# EAGLE schematic DCToACInverter_schematic (EAGLE 9.7.0)
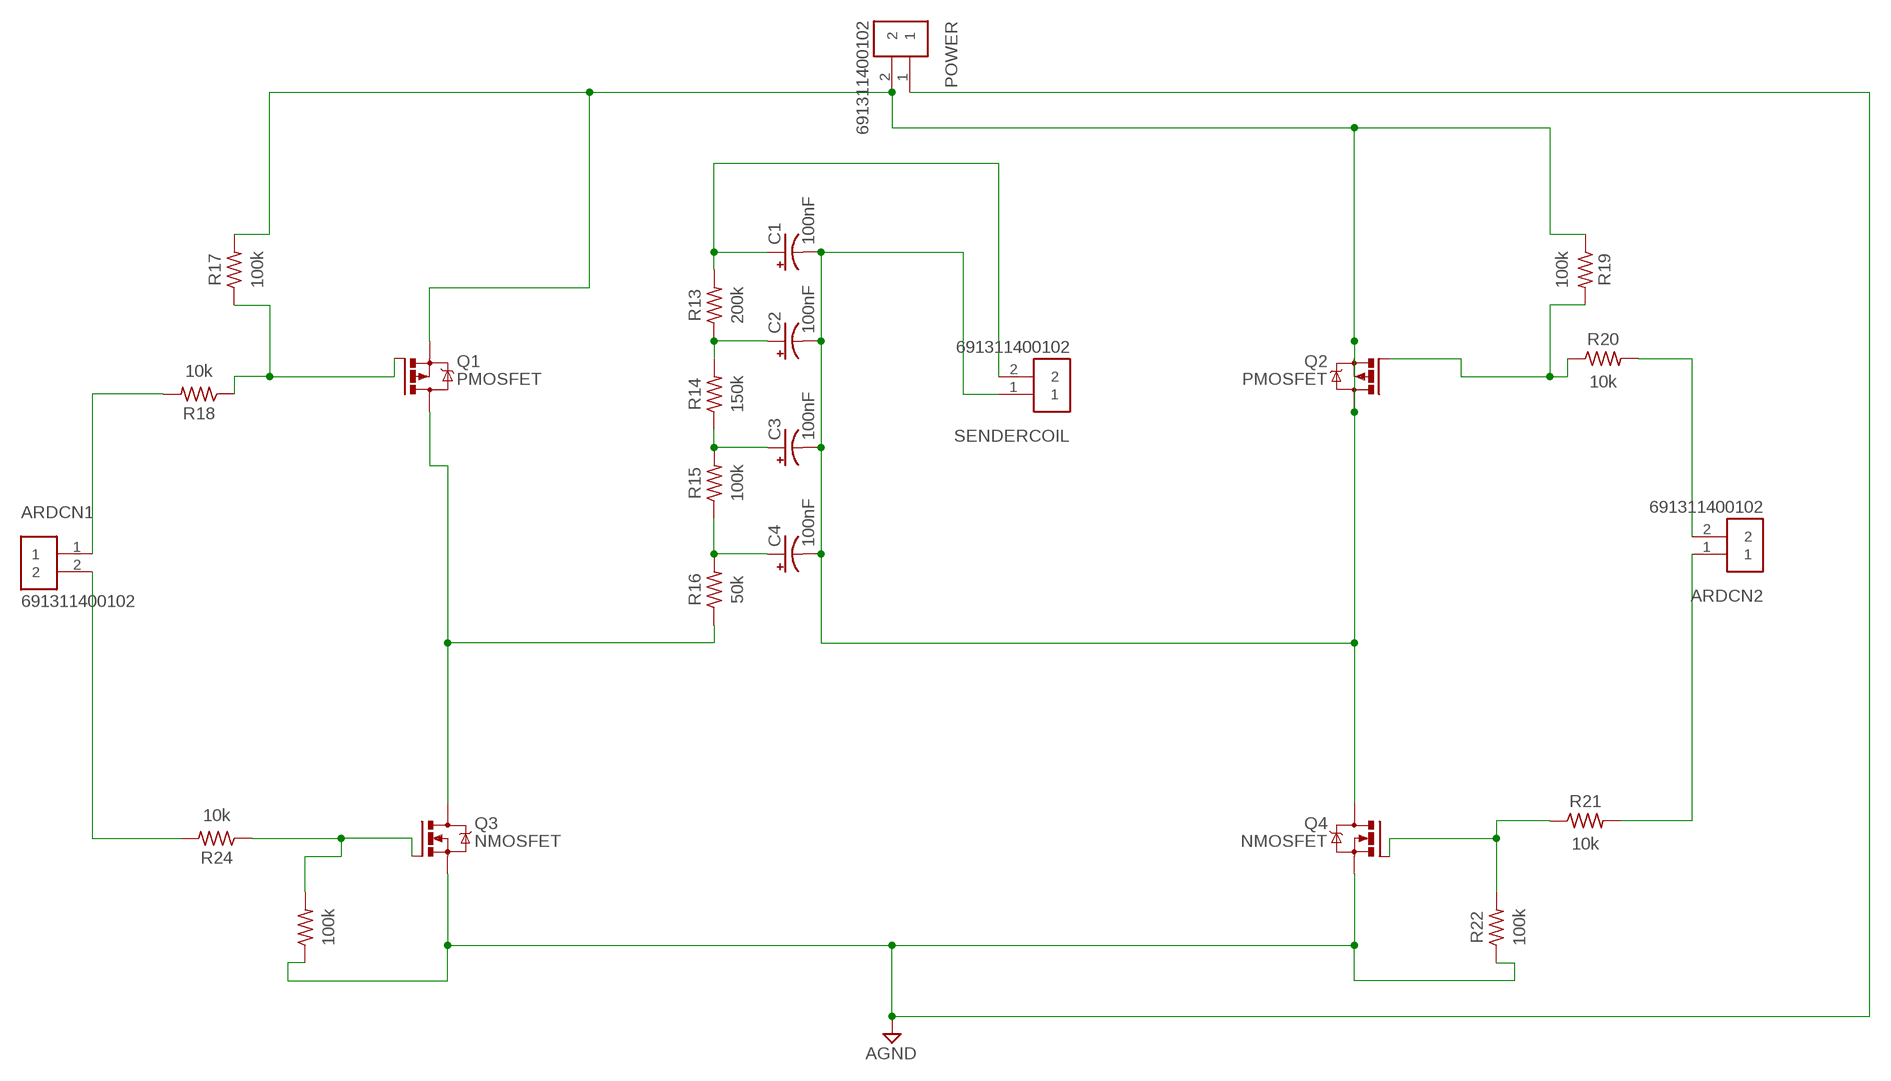
[diagram p0: schematic, sheet 1]

## Parts
ARDCN1  691311400102  [TERMINALBLOCK_PLUGGABLE-2-7.62MM]
ARDCN2  691311400102  [TERMINALBLOCK_PLUGGABLE-2-7.62MM]
C1  100nF  C-POL-US_AXIAL-34.1MM-PITCH  [CAPPAD3410W80L3025D1825B]
C2  100nF  C-POL-US_AXIAL-34.1MM-PITCH  [CAPPAD3410W80L3025D1825B]
C3  100nF  C-POL-US_AXIAL-34.1MM-PITCH  [CAPPAD3410W80L3025D1825B]
C4  100nF  C-POL-US_AXIAL-34.1MM-PITCH  [CAPPAD3410W80L3025D1825B]
POWER  691311400102  [TERMINALBLOCK_PLUGGABLE-2-7.62MM]
Q1  PMOSFET  PMOSFET_SOT23-GSD  [SOT23]
Q2  PMOSFET  PMOSFET_SOT23-GSD  [SOT23]
Q3  NMOSFET  NMOSFET_TO220  [TO220BV]
Q4  NMOSFET  NMOSFET_TO220  [TO220BV]
R13  200k  R-US_AXIAL-7.2MM-PITCH  [RESAD724W46L381D178B]
R14  150k  R-US_AXIAL-7.2MM-PITCH  [RESAD724W46L381D178B]
R15  100k  R-US_AXIAL-7.2MM-PITCH  [RESAD724W46L381D178B]
R16  50k  R-US_AXIAL-7.2MM-PITCH  [RESAD724W46L381D178B]
R17  100k  R-US_AXIAL-7.2MM-PITCH  [RESAD724W46L381D178B]
R18  10k  R-US_AXIAL-7.2MM-PITCH  [RESAD724W46L381D178B]
R19  100k  R-US_AXIAL-7.2MM-PITCH  [RESAD724W46L381D178B]
R20  10k  R-US_AXIAL-7.2MM-PITCH  [RESAD724W46L381D178B]
R21  10k  R-US_AXIAL-7.2MM-PITCH  [RESAD724W46L381D178B]
R22  100k  R-US_AXIAL-7.2MM-PITCH  [RESAD724W46L381D178B]
R23  100k  R-US_AXIAL-7.2MM-PITCH  [RESAD724W46L381D178B]
R24  10k  R-US_AXIAL-7.2MM-PITCH  [RESAD724W46L381D178B]
SENDERCOIL  691311400102  [TERMINALBLOCK_PLUGGABLE-2-7.62MM]

## Nets
AGND: POWER.1 Q3.S Q4.S R22.1 R23.1
N$1: Q1.1(G) R17.1 R18.1
N$2: C1.1(+) R13.2 SENDERCOIL.2
N$3: Q2.1(G) R19.2 R20.1
N$4: C2.1(+) R13.1 R14.2
N$5: Q3.G R23.2 R24.1
N$6: C3.1(+) R14.1 R15.2
N$7: Q1.3(D) Q3.D R16.1
N$8: Q4.G R21.1 R22.2
N$9: C4.1(+) R15.1 R16.2
N$10: ARDCN2.2 R20.2
N$11: ARDCN2.1 R21.2
N$12: ARDCN1.1 R18.2
N$13: ARDCN1.2 R24.2
N$14: C1.2(-) C2.2(-) C3.2(-) C4.2(-) POWER.2 Q1.2(S) Q2.2(S) Q2.3(D) Q4.D R17.2 R19.1 SENDERCOIL.1

## Library data of the parts
ARDCN1 ARDCN2 POWER SENDERCOIL = Terminal Blocks:691311400102: 7.62MM CLOSE VERTICAL PCB HEADER WR-TBL Manufacturer's datasheet <https://katalog.we-online.com/em/datasheet/6913114001xx.pdf>; CREATED_BY: PCBLayout.com; DIGIKEY_PART_NO: 732-2823-ND; MANUFACTURER: WURTH ELEKTRONIK; MPN: 691311400102
C1-C4 = Capacitor:C-POL-US: Capacitor Polarised - ANSI; CATEGORY: Capacitor
Q1 Q2 = Transistor:PMOSFET: P-Channel MOSFET - Generic; CATEGORY: Transistor; SUB-CATEGORY: MOSFET; TYPE: P-Channel
Q3 Q4 = Transistor:NMOSFET: N-Channel MOSFET - Generic; CATEGORY: Transistor; SUB-CATEGORY: MOSFET; TYPE: N-Channel
R13-R24 = Resistor:R-US: Resistor Fixed - ANSI; CATEGORY: Resistor; SUB-CATEGORY: Fixed